# Altium schematic sheet CTR_Power_Supply.SchDoc: Power Supplies
size A4; DrawnBy: Andrei Divinagracia; Revision: 0A; SheetNumber: 4; SheetTotal: 10
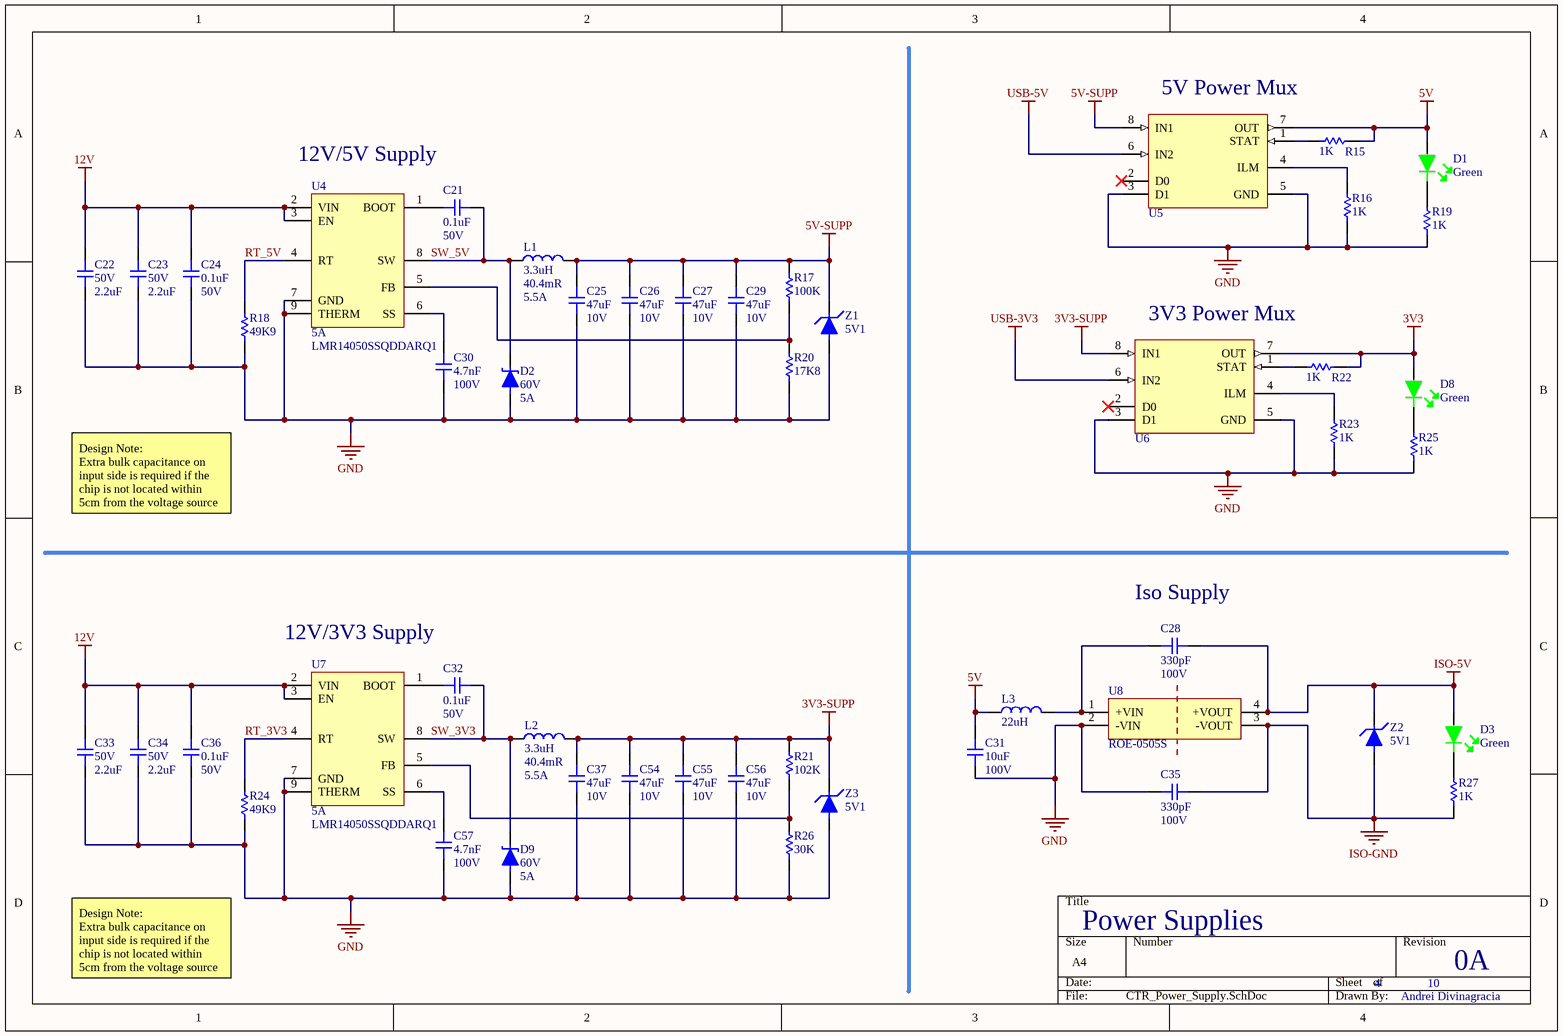
[diagram p0: CTR_Power_Supply.SchDoc]

## Parts
C21  0.1uF  Voltage Rating: 50V  [CAP-0603]
C22  Voltage Rating: 50V  Capacitance: 2.2uF  [CAP-0805]  (hidden comment: 0805-2.2uF-50V)
C23  Voltage Rating: 50V  Capacitance: 2.2uF  [CAP-0805]  (hidden comment: 0805-2.2uF-50V)
C24  0.1uF  Voltage Rating: 50V  [CAP-0603]
C25  47uF  Voltage Rating: 10V  [CAP-1206]
C26  47uF  Voltage Rating: 10V  [CAP-1206]
C27  47uF  Voltage Rating: 10V  [CAP-1206]
C28  330pF  Voltage Rating: 100V  [CAP-0805]
C29  47uF  Voltage Rating: 10V  [CAP-1206]
C30  4.7nF  Voltage Rating: 100V  [CAP-0603]
C31  10uF  Voltage Rating: 100V
C32  0.1uF  Voltage Rating: 50V  [CAP-0603]
C33  Voltage Rating: 50V  Capacitance: 2.2uF  [CAP-0805]  (hidden comment: 0805-2.2uF-50V)
C34  Voltage Rating: 50V  Capacitance: 2.2uF  [CAP-0805]  (hidden comment: 0805-2.2uF-50V)
C35  330pF  Voltage Rating: 100V  [CAP-0805]
C36  0.1uF  Voltage Rating: 50V  [CAP-0603]
C37  47uF  Voltage Rating: 10V  [CAP-1206]
C54  47uF  Voltage Rating: 10V  [CAP-1206]
C55  47uF  Voltage Rating: 10V  [CAP-1206]
C56  47uF  Voltage Rating: 10V  [CAP-1206]
C57  4.7nF  Voltage Rating: 100V  [CAP-0603]
D1  Green  [LED-0603]
D2  Voltage Rating (DC): 60V  Current Rating: 5A  [DO-214AB, SMC]  (hidden comment: B560C-13-F)
D3  Green  [LED-0603]
D8  Green  [LED-0603]
D9  Voltage Rating (DC): 60V  Current Rating: 5A  [DO-214AB, SMC]  (hidden comment: B560C-13-F)
L1  Inductance: 3.3uH  DC Resistance (DCR): 40.4mR  Current Rating: 5.5A  [INDM5252X30N]  (hidden comment: IND-3.3uH-5.5A)
L2  Inductance: 3.3uH  DC Resistance (DCR): 40.4mR  Current Rating: 5.5A  [INDM5252X30N]  (hidden comment: IND-3.3uH-5.5A)
L3  22uH  [IND-4532]
R15  1K  [RES-0603]
R16  1K  [RES-0603]
R17  100K
R18  49K9  [RES-0603]
R19  1K  [RES-0603]
R20  17K8  [RES-0603]
R21  102K  [RES-0603]
R22  1K  [RES-0603]
R23  1K  [RES-0603]
R24  49K9  [RES-0603]
R25  1K  [RES-0603]
R26  30K  [RES-0603]
R27  1K  [RES-0603]
U4  Output Current: 5A  [8-SOIC W THRM]  (hidden comment: LMR14050SSQDDARQ1)
U5  TPS2115APWR  [8-TSSOP-POW-SW]  (value not drawn)
U6  TPS2115APWR  [8-TSSOP-POW-SW]  (value not drawn)
U7  Output Current: 5A  [8-SOIC W THRM]  (hidden comment: LMR14050SSQDDARQ1)
U8  ROE-0505S  [ROE-0505S]
Z1  5V1  [SOD-123]
Z2  5V1  [SOD-123]
Z3  5V1  [SOD-123]

## Nets
3V3: D8.1 R22.2 U6.7(OUT)
3V3-SUPP: C37.2 C54.2 C55.2 C56.2 L2.2 R21.2 U6.8(IN1) Z3.1
5V: C31.2 D1.1 L3.1 R15.2 U5.7(OUT)
5V-SUPP: C25.2 C26.2 C27.2 C29.2 L1.2 R17.1 U5.8(IN1) Z1.1
12V: C22.1 C23.1 C24.2 C33.1 C34.1 C36.2 U4.2(VIN) U4.3(EN) U7.2(VIN) U7.3(EN)
GND: C22.2 C23.2 C24.1 C25.1 C26.1 C27.1 C29.1 C30.1 C31.1 C33.2 C34.2 C35.1 C36.1 C37.1 C54.1 C55.1 C56.1 C57.1 D2.2 D9.2 R16.1 R18.1 R19.1 R20.1 R23.1 R24.1 R25.1 R26.1 U4.7(GND) U4.9(THERM) U5.3(D1) U5.5(GND) U6.3(D1) U6.5(GND) U7.7(GND) U7.9(THERM) U8.2(-VIN) Z1.2 Z3.2
ISO-5V: C28.2 D3.1 U8.4(+VOUT) Z2.1
ISO-GND: C35.2 R27.1 U8.3(-VOUT) Z2.2
USB-3V3: U6.6(IN2)
USB-5V: U5.6(IN2)
RT_3V3: R24.2 U7.4(RT)
RT_5V: R18.2 U4.4(RT)
SW_3V3: C32.1 D9.1 L2.1 U7.8(SW)
SW_5V: C21.1 D2.1 L1.1 U4.8(SW)
NetC21_2: C21.2 U4.1(BOOT)
NetC28_1: C28.1 L3.2 U8.1(+VIN)
NetC30_2: C30.2 U4.6(SS)
NetC32_2: C32.2 U7.1(BOOT)
NetC57_2: C57.2 U7.6(SS)
NetD1_2: D1.2 R19.2
NetD3_2: D3.2 R27.2
NetD8_2: D8.2 R25.2
NetR15_1: R15.1 U5.1(STAT)
NetR16_2: R16.2 U5.4(ILM)
NetR17_2: R17.2 R20.2 U4.5(FB)
NetR21_1: R21.1 R26.2 U7.5(FB)
NetR22_1: R22.1 U6.1(STAT)
NetR23_2: R23.2 U6.4(ILM)

Not connected (* = marked no-connect by the designer): U5 2(D0)*; U6 2(D0)*

## Notes on the sheet
- (near U5) 5V Power Mux
- 12V/5V Supply
- 3V3 Power Mux
- Design Note:
  Extra bulk capacitance on input side is required if the chip is not located within 5cm from the voltage source
- 12V/3V3 Supply
- (near C28) Iso Supply

## Library data of the parts
C21 C24 C32 C36 = 0603-0.1uF-50V: CAP CER 0.1UF 50V X7R 0603; Manufacturer: Samsung; Manufacturer Part Number: CL10B104KB8NNNL; Capacitance: 100nF; Tolerance: 10%; Supplier 1: Digi-Key; Stock 1: 1355979; Pricing 1: 1=0.1, 10=0.03, 50=0.0164, 100=0.0134, 500=0.00958, 1000=0.00753, 2500=0.00684, 5000=0.0063 (USD); Mount: Surface Mount; Case/Package: 0603; Min Operating Temperature: -55°C; Max Operating Temperature: 125°C; Packaging: Tape and Reel; Package Quantity: 15000; Dielectric: X7R; Voltage Rating (DC): 50V; Series: CL; Construction: Flat; Length: 1.6mm; Width: 0.031inch; Height: 0.8mm; Thickness: 0.035inch; Depth: 0.8mm; Radiation Hardening: No; RoHS Compliant: Yes; ComponentLink1URL: https://www.verical.com/server-webapp/html/getDatasheet?partID=357523&src-supplier=Verical; ComponentLink1Description: https://www.verical.com/server-webapp/html/getDatasheet?partID=357523&src-supplier=Verical; ComponentLink2URL: https://media.digikey.com/pdf/Data%20Sheets/Samsung%20PDFs/CL_Series_MLCC_ds.pdf?src-supplier=Digi-Key; ComponentLink2Description: https://media.digikey.com/pdf/Data%20Sheets/Samsung%20PDFs/CL_Series_MLCC_ds.pdf?src-supplier=Digi-Key; Supplier Part Number 1: 1276-CL10B104KB8NNNLCT-ND
C22 C23 C33 C34 = 0805-2.2uF-50V: CAP CER 2.2UF 50V X5R 0805; Manufacturer: Samsung; Manufacturer Part Number: CL21A225KBFNNNE; Tolerance: 10%; Supplier 1: Digi-Key; Stock 1: 30848; Pricing 1: 1=0.25, 10=0.173, 50=0.1154, 100=0.0981, 500=0.06928, 1000=0.06062 (USD); Mount: Surface Mount; Case/Package: 0805; Case Code (Metric): 2012; Case Code (Imperial): 0805; Min Operating Temperature: -55°C; Max Operating Temperature: 85°C; Packaging: Tape and Reel; Dielectric: X5R; Voltage Rating (DC): 50V; Length: 0.079inch; Width: 0.049inch; Thickness: 0.053inch; ComponentLink1URL: http://www.samsungsem.com/kr/support/product-search/mlcc/CL21A225KBFNNNE.jsp?src-supplier=Digi-Key; ComponentLink1Description: http://www.samsungsem.com/kr/support/product-search/mlcc/CL21A225KBFNNNE.jsp?src-supplier=Digi-Key; Supplier Part Number 1: 1276-6702-1-ND
C25-C27 C29 C37 C54-C56 = 1206-47uF: CAP CER 47UF 10V X5R 1206; Manufacturer: Samsung; Manufacturer Part Number: CL31A476MPHNNNE; Material: Ceramic; Tolerance: 20%; Supplier 1: Digi-Key; Stock 1: 88504; Pricing 1: 1=0.5, 10=0.35, 50=0.2646, 100=0.2305, 500=0.1707, 1000=0.1451 (USD); Mount: Surface Mount; Case/Package: 1206; Case Code (Metric): 3216; Case Code (Imperial): 1206; Min Operating Temperature: -55°C; Max Operating Temperature: 85°C; Package Quantity: 1; Packaging: Tape and Reel; Capacitance: 47uF; Dielectric: X5R; Length: 3.2mm; Width: 0.063inch; Thickness: 0.071inch; Depth: 1.6mm; Radiation Hardening: No; RoHS Compliant: Yes; ComponentLink1URL: https://media.digikey.com/pdf/Data%20Sheets/Samsung%20PDFs/CL_Series_MLCC_ds.pdf?src-supplier=Digi-Key; ComponentLink1Description: https://media.digikey.com/pdf/Data%20Sheets/Samsung%20PDFs/CL_Series_MLCC_ds.pdf?src-supplier=Digi-Key; ComponentLink2URL: https://www.verical.com/server-webapp/html/getDatasheet?partID=467074&src-supplier=Verical; ComponentLink2Description: https://www.verical.com/server-webapp/html/getDatasheet?partID=467074&src-supplier=Verical; ComponentLink3URL: https://produktinfo.conrad.com/datenblaetter/450000-474999/452069-da-01-en-VS_KONDENSATOR_1206.pdf?src-supplier=Conrad; ComponentLink3Description: https://produktinfo.conrad.com/datenblaetter/450000-474999/452069-da-01-en-VS_KONDENSATOR_1206.pdf?src-supplier=Conrad; Supplier Part Number 1: 1276-3063-1-ND
C28 C35 = 0805-330pF-100V: CAP CER 330PF 100V X7R 0805; Manufacturer: Wurth Electronics; Manufacturer Part Number: 885012207113; Tolerance: 10%; Supplier 1: Digi-Key; Stock 1: 3105; Pricing 1: 1=0.1, 10=0.049, 100=0.0441, 500=0.03904 (USD); Mount: Surface Mount; Case/Package: 0805; Case Code (Imperial): 0805; Case Code (Metric): 2012; Min Operating Temperature: -55°C; Max Operating Temperature: 125°C; Packaging: Tape and Reel; Capacitance: 330pF; ComponentLink1URL: https://katalog.we-online.de/pbs/datasheet/885012207113.pdf?src-supplier=Digi-Key; ComponentLink1Description: https://katalog.we-online.de/pbs/datasheet/885012207113.pdf?src-supplier=Digi-Key; Supplier Part Number 1: 732-12232-6-ND
C30 C57 = 0603-4.7nF-100V: CAP CER 4700PF 100V X7R 0603; Manufacturer: TDK; Manufacturer Part Number: CGA3E2X7R2A472K080AA; Tolerance: 10%; Supplier 1: Digi-Key; Stock 1: 106501; Pricing 1: 1=0.1, 10=0.067, 50=0.0364, 100=0.0296, 500=0.02118, 1000=0.01664 (USD); Mount: Surface Mount; Case/Package: 0603; Case Code (Metric): 1608; Case Code (Imperial): 0603; Weight: 7.1E-05oz; Min Operating Temperature: -55°C; Max Operating Temperature: 125°C; Capacitance: 4.7nF; Packaging: Tape and Reel; Package Quantity: 1; Voltage Rating (DC): 100V; Dielectric: X7R; Termination: SMD/SMT; Resistor Type: Ceramic; Series: CGA; Length: 1.6mm; Width: 0.031inch; Height: 0.8mm; Thickness: 0.035inch; Depth: 0.8mm; Ratings: AEC-Q200; REACH SVHC: No SVHC; RoHS Compliant: Yes; ComponentLink1URL: http://www.farnell.com/datasheets/1807242.pdf?src-supplier=Element14; ComponentLink1Description: http://www.farnell.com/datasheets/1807242.pdf?src-supplier=Element14; ComponentLink2URL: http://www.mouser.com/ds/2/400/lcc_automotive_midvoltage_en-355485.pdf?src-supplier=Mouser; ComponentLink2Description: http://www.mouser.com/ds/2/400/lcc_automotive_midvoltage_en-355485.pdf?src-supplier=Mouser; Supplier Part Number 1: 445-5810-1-ND
C31 = 2220-10uF-100V: CAP CER 10UF 100V X7S 2220; Manufacturer: TDK; Manufacturer Part Number: C5750X7S2A106K230KB; Tolerance: 10%; Supplier 1: Digi-Key; Stock 1: 112223; Pricing 1: 1=2.24, 10=1.815, 50=1.584, 100=1.386 (USD); Mount: Surface Mount; Case/Package: 2220; Case Code (Metric): 5750; Case Code (Imperial): 2220; Weight: 0.016932oz; Min Operating Temperature: -55°C; Max Operating Temperature: 125°C; Package Quantity: 500; Packaging: Tape and Reel; Capacitance: 10uF; Dielectric: X7S; Termination: SMD/SMT; Voltage Rating (DC): 100V; Series: C; Length: 0.224inch; Width: 0.197inch; Height: 2.3mm; Thickness: 0.098inch; REACH SVHC: No SVHC; Lead Free: Lead Free; RoHS Compliant: Yes; ComponentLink1URL: https://4donline.ihs.com/images/VipMasterIC/IC/TDKC/TDKC-S-A0000596732/TDKC-S-A0000596732-1.pdf?hkey=52A5661711E402568146F3353EA87419&src-supplier=Farnell; ComponentLink1Description: https://4donline.ihs.com/images/VipMasterIC/IC/TDKC/TDKC-S-A0000596732/TDKC-S-A0000596732-1.pdf?hkey=52A5661711E402568146F3353EA87419&src-supplier=Farnell; ComponentLink2URL: http://www.farnell.com/datasheets/1913358.pdf?src-supplier=Element14; ComponentLink2Description: http://www.farnell.com/datasheets/1913358.pdf?src-supplier=Element14; ComponentLink3URL: https://product.tdk.com/info/en/documents/chara_sheet/C5750X7S2A106K230KB.pdf?src-supplier=Digi-Key; ComponentLink3Description: https://product.tdk.com/info/en/documents/chara_sheet/C5750X7S2A106K230KB.pdf?src-supplier=Digi-Key; ComponentLink4URL: http://www.mouser.com/ds/2/400/lcc_commercial_general_en-837201.pdf?src-supplier=Mouser; ComponentLink4Description: http://www.mouser.com/ds/2/400/lcc_commercial_general_en-837201.pdf?src-supplier=Mouser; ComponentLink5URL: https://4donline.ihs.com/images/VipMasterIC/IC/TDKC/TDKC-S-A0000596732/TDKC-S-A0000596732-1.pdf?hkey=52A5661711E402568146F3353EA87419&src-supplier=Newark; ComponentLink5Description: https://4donline.ihs.com/images/VipMasterIC/IC/TDKC/TDKC-S-A0000596732/TDKC-S-A0000596732-1.pdf?hkey=52A5661711E402568146F3353EA87419&src-supplier=Newark; ComponentLink6URL: http://product.tdk.com/en/catalog/datasheets/mlcc_commercial_midvoltage_en.pdf?src-supplier=Avnet; ComponentLink6Description: http://product.tdk.com/en/catalog/datasheets/mlcc_commercial_midvoltage_en.pdf?src-supplier=Avnet; Supplier Part Number 1: 445-13408-6-ND
D1 D3 D8 = LED-Green: LED GREEN CLEAR 0603 SMD; Manufacturer: Wurth Electronics; Manufacturer Part Number: 150060VS75000; Luminous Intensity: 40mcd; Viewing Angle: 140°; Forward Voltage: 2V; Wavelength: 570nm; Lens Style: Clear,Rectangular; Forward Current: 30mA; Test Current: 20mA; Supplier 1: Digi-Key; Stock 1: 118118; Pricing 1: 1=0.14, 50=0.133, 100=0.114, 500=0.099 (USD); Mount: Surface Mount; Case/Package: 0603; Number of Pins: 2; Color: Green; Case Code (Metric): 1608; Case Code (Imperial): 0603; Min Operating Temperature: -40°C; Max Operating Temperature: 85°C; Package Quantity: 1; Packaging: Tape and Reel; Dominant Wavelength: 570nm; Length: 1.6mm; Height: 0.7mm; Width: 0.8mm; REACH SVHC: Unknown; ComponentLink1URL: https://katalog.we-online.de/led/datasheet/150060VS75000.pdf?src-supplier=Digi-Key; ComponentLink1Description: https://katalog.we-online.de/led/datasheet/150060VS75000.pdf?src-supplier=Digi-Key; Supplier Part Number 1: 732-4980-1-ND
D2 D9 = B560C-13-F: DIODE SCHOTTKY 60V 5A SMC; Manufacturer: Diodes; Max Reverse Current: 500uA; Forward Voltage: 700mV; Max Forward Surge Current (Ifsm): 100A; Element Configuration: Single; Polarity: Standard; Capacitance: 300pF; Supplier 1: Digi-Key; Manufacturer Part Number: B560C-13-F; Stock 1: 50354; Pricing 1: 1=0.53, 10=0.454, 100=0.3388, 500=0.2662, 1000=0.2057 (USD); Mount: Surface Mount; Case/Package: SMC; Number of Pins: 2; Weight: 0.007408oz; Contact Plating: Tin,Matte; Min Operating Temperature: -55°C; Max Operating Temperature: 125°C; Package Quantity: 3000; Packaging: Tape and Reel; Forward Current: 5A; Max Repetitive Reverse Voltage (Vrrm): 60V; Average Rectified Current: 5A; Peak Non-Repetitive Surge Current: 100A; Termination: SMD/SMT; Output Current: 5A; Max Reverse Voltage (DC): 60V; Series: -; Length: 7.11mm; Width: 6.22mm; Height: 2.5mm; Radiation Hardening: No; REACH SVHC: No SVHC; Lead Free: Lead Free; RoHS Compliant: Yes; ComponentLink1URL: https://www.diodes.com/assets/Datasheets/ds13012.pdf?src-supplier=Digi-Key; ComponentLink1Description: https://www.diodes.com/assets/Datasheets/ds13012.pdf?src-supplier=Digi-Key; ComponentLink2URL: http://www.farnell.com/datasheets/2238476.pdf?src-supplier=Element14; ComponentLink2Description: http://www.farnell.com/datasheets/2238476.pdf?src-supplier=Element14; ComponentLink3URL: https://www.verical.com/server-webapp/html/getDatasheet?partID=89786&src-supplier=Verical; ComponentLink3Description: https://www.verical.com/server-webapp/html/getDatasheet?partID=89786&src-supplier=Verical; ComponentLink4URL: http://www.diodes.com/datasheets/ds13012.pdf?src-supplier=Future+Electronics; ComponentLink4Description: http://www.diodes.com/datasheets/ds13012.pdf?src-supplier=Future+Electronics; ComponentLink5URL: http://www.diodes.com//datasheets/ds13012.pdf?src-supplier=Avnet+Europe; ComponentLink5Description: http://www.diodes.com//datasheets/ds13012.pdf?src-supplier=Avnet+Europe; ComponentLink6URL: http://www.jameco.com/Jameco/Products/ProdDS/1538961.pdf?src-supplier=Jameco; ComponentLink6Description: http://www.jameco.com/Jameco/Products/ProdDS/1538961.pdf?src-supplier=Jameco; ComponentLink7URL: http://datasheet.iiic.cc/diodes/B560C-13-F.pdf?src-supplier=IIIC; ComponentLink7Description: http://datasheet.iiic.cc/diodes/B560C-13-F.pdf?src-supplier=IIIC; Supplier Part Number 1: B560C-FDICT-ND
L1 L2 = IND-3.3uH-5.5A: FIXED IND 3.3UH 5.5A 40.4MOHM SM; Manufacturer: Vishay Dale; Manufacturer Part Number: IHLP2020CZER3R3M11; Inductance Tolerance: 20%; Shielding: Shielded; Saturation Current: 7A; Self Resonant Frequency: 29MHz; Test Frequency: 100kHz; Supplier 1: Digi-Key; Stock 1: 17207; Pricing 1: 1=1.29, 10=1.194, 25=1.1024, 50=0.9188, 100=0.8636, 250=0.77176, 500=0.6615, 1000=0.588 (USD); Mount: Surface Mount; Case/Package: 2020; Contact Plating: Tin; Min Operating Temperature: -55°C; Max Operating Temperature: 125°C; Tolerance: 20%; Package Quantity: 2000; Packaging: Tape and Reel; Max DC Current: 7A; Termination: SMD/SMT; RMS Current (Irms): 5.5A; Series: IHLP-2020CZ-11; Rated Current-Max: 5.5A; Length: 5.74mm; Width: 0.204inch; Height: 3mm; Height - Seated (Max): 0.118inch; Depth: 5.43mm; Radiation Hardening: No; REACH SVHC: Unknown; Military Standard: Not; Lead Free: Lead Free; ComponentLink1URL: http://www.farnell.com/datasheets/480942.pdf?src-supplier=Element14; ComponentLink1Description: http://www.farnell.com/datasheets/480942.pdf?src-supplier=Element14; ComponentLink2URL: http://www.vishay.com/docs/34260/ihlp2020cz11.pdf?src-supplier=Digi-Key; ComponentLink2Description: http://www.vishay.com/docs/34260/ihlp2020cz11.pdf?src-supplier=Digi-Key; ComponentLink3URL: http://www.mouser.com/ds/2/427/ihlp2020cz11-270739.pdf?src-supplier=Mouser; ComponentLink3Description: http://www.mouser.com/ds/2/427/ihlp2020cz11-270739.pdf?src-supplier=Mouser; ComponentLink4URL: http://uk.rs-online.com/webdocs/102c/0900766b8102c930.pdf?src-supplier=RSComponents; ComponentLink4Description: http://uk.rs-online.com/webdocs/102c/0900766b8102c930.pdf?src-supplier=RSComponents; ComponentLink5URL: http://www.vishay.com/docs/34260/lp20cz11.pdf?src-supplier=Avnet; ComponentLink5Description: http://www.vishay.com/docs/34260/lp20cz11.pdf?src-supplier=Avnet; Supplier Part Number 1: 541-1237-1-ND
L3 = IND-22uH-630mA: FIXED IND 22UH 630MA 700MOHM SMD; Manufacturer: Recom; Manufacturer Part Number: RLS-226; Supplier 1: Digi-Key; Stock 1: 512; Pricing 1: 1=0.72, 5=0.714, 10=0.704, 25=0.6832, 50=0.6626, 250=0.62116, 500=0.57974 (USD); ComponentLink1URL: https://www.recom-power.com/pdf/Accessories/RLS-226.pdf?src-supplier=Digi-Key; ComponentLink1Description: https://www.recom-power.com/pdf/Accessories/RLS-226.pdf?src-supplier=Digi-Key; Supplier Part Number 1: 945-30004971-ND
R15 R16 R19 R22 R23 R25 R27 = 0603-1KR: RES SMD 1K OHM 1% 1/10W 0603; Manufacturer: Vishay Dale; Manufacturer Part Number: CRCW06031K00FKEA; Resistance: 1kR; Power Rating: 100mW; Voltage Rating: 75V; Temperature Coefficient: 100ppm/°C; Supplier 1: Digi-Key; Stock 1: 671453; Pricing 1: 1=0.1, 10=0.034, 100=0.0139, 1000=0.00623, 2500=0.0054 (USD); Mount: Surface Mount; Case/Package: 0603; Number of Pins: 2; Weight: 7.1E-05oz; Case Code (Metric): 1608; Case Code (Imperial): 0603; Contact Plating: Tin; Min Operating Temperature: -55°C; Max Operating Temperature: 155°C; Composition: Thick Film; Tolerance: 1%; Packaging: Tape and Reel; Package Quantity: 10; Number of Terminations: 2; Termination: SMD/SMT; Military Standard: Not; Max Power Dissipation: 100mW; Voltage Rating (DC): 75V; Features: Automotive AEC-Q200; Length: 1.55mm; Height: 0.45mm; Width: 0.033inch; Depth: 0.85mm; Radiation Hardening: No; REACH SVHC: Unknown; Lead Free: Lead Free; ComponentLink1URL: http://www.vishay.com/docs/20035/dcrcwe3.pdf?src-supplier=Digi-Key; ComponentLink1Description: http://www.vishay.com/docs/20035/dcrcwe3.pdf?src-supplier=Digi-Key; ComponentLink2URL: http://uk.rs-online.com/webdocs/0d98/0900766b80d98afc.pdf?src-supplier=RSComponents; ComponentLink2Description: http://uk.rs-online.com/webdocs/0d98/0900766b80d98afc.pdf?src-supplier=RSComponents; ComponentLink3URL: http://www.vishay.com/docs/20035/dcrcwe3.pdf?src-supplier=Avnet; ComponentLink3Description: http://www.vishay.com/docs/20035/dcrcwe3.pdf?src-supplier=Avnet; ComponentLink4URL: http://www.vishay.com/docs/20035/dcrcwe3.pdf?src-supplier=Avnet+Asia; ComponentLink4Description: http://www.vishay.com/docs/20035/dcrcwe3.pdf?src-supplier=Avnet+Asia; ComponentLink5URL: http://www.farnell.com/datasheets/2310790.pdf?src-supplier=Element14; ComponentLink5Description: http://www.farnell.com/datasheets/2310790.pdf?src-supplier=Element14; ComponentLink6URL: https://www.distrelec.biz/Web/Downloads/a_/en/flD-CRCW-e3_data_en.pdf?mime=application%2Fpdf&src-supplier=Distrelec; ComponentLink6Description: https://www.distrelec.biz/Web/Downloads/a_/en/flD-CRCW-e3_data_en.pdf?mime=application%2Fpdf&src-supplier=Distrelec; ComponentLink7URL: http://www.vishay.com/docs/20035/dcrcwe3.pdf?src-supplier=Future+Electronics; ComponentLink7Description: http://www.vishay.com/docs/20035/dcrcwe3.pdf?src-supplier=Future+Electronics; ComponentLink8URL: http://www.vishay.com/docs/20035/dcrcwe3.pdf?src-supplier=Avnet+Europe; ComponentLink8Description: http://www.vishay.com/docs/20035/dcrcwe3.pdf?src-supplier=Avnet+Europe; Supplier Part Number 1: 541-1.00KHCT-ND
R17 = 0603-100K: RES SMD 100K OHM 1% 1/10W 0603; Manufacturer: Yageo; Manufacturer Part Number: RC0603FR-07100KL; Resistance: 100kR; Power Rating: 100mW; Voltage Rating: 50V; Temperature Coefficient: 100ppm/°C; Working Voltage: 75V; Supplier 1: Digi-Key; Stock 1: 11174551; Pricing 1: 1=0.1, 10=0.024, 100=0.0097, 1000=0.00436, 2500=0.00378 (USD); Case/Package: 0603; Number of Pins: 2; Case Code (Imperial): 0603; Case Code (Metric): 1608; Min Operating Temperature: -55°C; Max Operating Temperature: 155°C; Tolerance: 1%; Packaging: Tape and Reel; Termination: SMD/SMT; Resistor Type: Thick Film; Number of Terminations: 2; Features: Moisture Resistant; Series: RC; Max Power Dissipation: 100mW; Resistance Tolerance: 1%; Construction: Rectangular; Voltage Rating (DC): 50V; Technology: THICK FILM; Length: 1.6mm; Width: 0.8mm; Height: 0.45mm; Depth: 0.8mm; REACH SVHC: No SVHC; Military Standard: Not; Lead Free: Lead Free; RoHS Compliant: Yes; ComponentLink1URL: http://www.farnell.com/datasheets/2167052.pdf?src-supplier=Element14; ComponentLink1Description: http://www.farnell.com/datasheets/2167052.pdf?src-supplier=Element14; ComponentLink2URL: http://www.farnell.com/datasheets/443971.pdf?src-supplier=Element14; ComponentLink2Description: http://www.farnell.com/datasheets/443971.pdf?src-supplier=Element14; ComponentLink3URL: http://documents.rs-components.com/techlib://itc_doclist_GB.htm?stockno=5048940&src-supplier=RSComponents; ComponentLink3Description: http://documents.rs-components.com/techlib://itc_doclist_GB.htm?stockno=5048940&src-supplier=RSComponents; ComponentLink4URL: http://www.farnell.com/datasheets/1868787.pdf?src-supplier=Element14; ComponentLink4Description: http://www.farnell.com/datasheets/1868787.pdf?src-supplier=Element14; Supplier Part Number 1: 311-100KHRCT-ND
R18 R24 = 0603-49K9: RES SMD 49.9KOHM 0.5% 1/10W 0603; Manufacturer: Vishay Dale; Manufacturer Part Number: CRCW060349K9DHEAP; Resistance: 49.9kR; Max Power Dissipation: 100mW; Temperature Coefficient: 50ppm/°C; Supplier 1: Digi-Key; Stock 1: 30757; Pricing 1: 1=0.3, 10=0.253, 100=0.0989, 1000=0.0414, 2500=0.03795 (USD); Case/Package: 0603; Case Code (Imperial): 0603; Case Code (Metric): 1608; Min Operating Temperature: -55°C; Max Operating Temperature: 155°C; Resistor Type: Thick Film; Features: Automotive AEC-Q200; Packaging: Tape and Reel; Tolerance: 0.5%; Number of Terminations: 2; Series: CRCW-P; RoHS Compliant: Yes; ComponentLink1URL: http://www.vishay.com/docs/20036/dcrcwpe3.pdf?src-supplier=Digi-Key; ComponentLink1Description: http://www.vishay.com/docs/20036/dcrcwpe3.pdf?src-supplier=Digi-Key; ComponentLink2URL: https://www.vishay.com/docs/20036/dcrcwpe3.pdf?src-supplier=Digi-Key; ComponentLink2Description: https://www.vishay.com/docs/20036/dcrcwpe3.pdf?src-supplier=Digi-Key; Supplier Part Number 1: 541-49.9KAYCT-ND
R20 = 0603-17K8: RES SMD 17.8K OHM 1% 1/10W 0603; Manufacturer: Yageo; Manufacturer Part Number: RC0603FR-0717K8L; Resistance: 17.8kR; Power Rating: 100mW; Voltage Rating: 75V; Temperature Coefficient: 100ppm/°C; Voltage Rating (DC): 50V; Supplier 1: Digi-Key; Stock 1: 302262; Pricing 1: 1=0.1, 10=0.024, 100=0.0097, 1000=0.00436, 2500=0.00378 (USD); Case/Package: 0603; Case Code (Metric): 1608; Case Code (Imperial): 0603; Size Code: 0603; Weight: 7.1E-05oz; Min Operating Temperature: -55°C; Max Operating Temperature: 155°C; Tolerance: 1%; Package Quantity: 1; Packaging: Tape and Reel; Resistor Type: Thick Film; Number of Terminations: 2; Termination: SMD/SMT; Max Power Dissipation: 100mW; Features: Moisture Resistant; Series: RC; Construction: Rectangular; Length: 1.6mm; Width: 0.031inch; Height: 0.022inch; Depth: 0.8mm; Military Standard: Not; Lead Free: Lead Free; RoHS Compliant: Yes; ComponentLink1URL: http://www.yageo.com/documents/recent/PYu-RC_Group_51_RoHS_L_10.pdf?src-supplier=Digi-Key; ComponentLink1Description: http://www.yageo.com/documents/recent/PYu-RC_Group_51_RoHS_L_10.pdf?src-supplier=Digi-Key; ComponentLink2URL: http://www.yageo.com/documents/recent/PYu-RC_Group_51_RoHS_L_9.pdf?src-supplier=Digi-Key; ComponentLink2Description: http://www.yageo.com/documents/recent/PYu-RC_Group_51_RoHS_L_9.pdf?src-supplier=Digi-Key; Supplier Part Number 1: 311-17.8KHRCT-ND
R21 = 0603-102K: RES SMD 102K OHM 1% 1/10W 0603; Manufacturer: Samsung; Manufacturer Part Number: RC1608F1023CS; Power Rating: 100mW; Resistance: 102kR; Temperature Coefficient: 100ppm/°C; Voltage Rating (DC): 50V; Supplier 1: Digi-Key; Stock 1: 4439; Pricing 1: 1=0.1, 10=0.074, 100=0.0285, 1000=0.01254, 2500=0.01083 (USD); Case/Package: 0603; Case Code (Metric): 1608; Case Code (Imperial): 0603; Contact Plating: Tin; Min Operating Temperature: -55°C; Max Operating Temperature: 155°C; Tolerance: 1%; Packaging: Tape and Reel; Resistor Type: Thick Film; Package Quantity: 1; Number of Terminations: 2; Max Power Dissipation: 100mW; Features: Moisture Resistant; Series: RC; Length: 0.063inch; Width: 0.031inch; Height: 0.022inch; Radiation Hardening: No; Lead Free: Lead Free; RoHS Compliant: Yes; ComponentLink1URL: https://produktinfo.conrad.com/datenblaetter/450000-474999/450136-da-01-en-WIDERSTAND_0603.pdf?src-supplier=Conrad; ComponentLink1Description: https://produktinfo.conrad.com/datenblaetter/450000-474999/450136-da-01-en-WIDERSTAND_0603.pdf?src-supplier=Conrad; Supplier Part Number 1: 1276-4839-1-ND
R26 = 0603-30KR: RES SMD 30K OHM 1% 1/10W 0603; Manufacturer: Yageo; Manufacturer Part Number: RC0603FR-0730KL; Resistance: 30kR; Power Rating: 100mW; Temperature Coefficient: 100ppm/°C; Voltage Rating (DC): 50V; Supplier 1: Digi-Key; Stock 1: 1047616; Pricing 1: 1=0.1, 10=0.023, 100=0.0094, 1000=0.00421, 2500=0.00366 (USD); Case/Package: 0603; Number of Pins: 2; Case Code (Imperial): 0603; Case Code (Metric): 1608; Min Operating Temperature: -55°C; Max Operating Temperature: 155°C; Tolerance: 1%; Packaging: Tape and Reel; Voltage Rating: 50V; Termination: SMD/SMT; Military Standard: Not; Composition: Thick Film; Package Quantity: 5000; Length: 1.6mm; Height: 0.45mm; Width: 0.8mm; Depth: 0.8mm; Lead Free: Lead Free; REACH SVHC: Unknown; ComponentLink1URL: http://www.mouser.com/catalog/specsheets/RC0603.pdf?src-supplier=Mouser; ComponentLink1Description: http://www.mouser.com/catalog/specsheets/RC0603.pdf?src-supplier=Mouser; ComponentLink2URL: http://www.farnell.com/datasheets/2167052.pdf?src-supplier=Element14; ComponentLink2Description: http://www.farnell.com/datasheets/2167052.pdf?src-supplier=Element14; Supplier Part Number 1: 311-30.0KHRDKR-ND
U4 U7 = LMR14050SSQDDARQ1: IC REG BUCK ADJUSTABLE 5A 8SOPWR; Manufacturer: Texas Instruments; Number of Outputs: 1; Min Input Voltage: 4V; Max Input Voltage: 40V; Min Output Voltage: 800mV; Max Output Voltage: 28V; Switching Frequency: 2.5MHz; Synchronous Rectifier: No; Quiescent Current: 40uA; Output Configuration: Positive; Supplier 1: Digi-Key; Stock 1: 3564; Pricing 1: 1=3.5, 10=3.143, 25=2.9716, 100=2.5755, 250=2.4434, 500=2.19246, 1000=2.08082 (USD); Mount: Surface Mount; Case/Package: SOIC; Min Operating Temperature: -40°C; Max Operating Temperature: 125°C; Packaging: Tape and Reel; Output Type: Adjustable; Lead Free: Lead Free; RoHS Compliant: Yes; ComponentLink1URL: http://www.ti.com/lit/ds/symlink/lmr14050-q1.pdf?src-supplier=Digi-Key; ComponentLink1Description: http://www.ti.com/lit/ds/symlink/lmr14050-q1.pdf?src-supplier=Digi-Key; ComponentLink2URL: http://www.ti.com/general/docs/suppproductinfo.tsp?distId=10&amp;gotoUrl=http%3A%2F%2Fwww.ti.com%2Flit%2Fgpn%2Flmr14050-q1&src-supplier=Digi-Key; ComponentLink2Description: http://www.ti.com/general/docs/suppproductinfo.tsp?distId=10&amp;gotoUrl=http%3A%2F%2Fwww.ti.com%2Flit%2Fgpn%2Flmr14050-q1&src-supplier=Digi-Key; ComponentLink3URL: http://www.ti.com/lit/gpn/lmr14050-q1?src-supplier=Mouser; ComponentLink3Description: http://www.ti.com/lit/gpn/lmr14050-q1?src-supplier=Mouser; Supplier Part Number 1: 296-43402-1-ND; Manufacturer Part Number: LMR14050SSQDDARQ1
U5 U6 = TPS2115APWR: IC OR CTRLR SRC SELECT 8TSSOP; Manufacturer: Texas Instruments; Number of Outputs: 1; Number of Inputs: 2; Output Current: 1.25A; Max Power Dissipation: 387mW; Max Input Voltage: 5.5V; Min Input Voltage: 2.8V; Turn-On Delay Time: 1ms; Turn-Off Delay Time: 5ms; Operating Supply Current: 55uA; On-State Resistance: 84mR; Output Voltage: 6V; Supplier 1: Digi-Key; Manufacturer Part Number: TPS2115APWR; Stock 1: 19599; Pricing 1: 1=2.48, 10=2.225, 25=2.0988, 100=1.7882, 250=1.67904, 500=1.46916, 1000=1.32264 (USD); Case/Package: TSSOP; Number of Pins: 8; Weight: 0.001376oz; Min Operating Temperature: -40°C; Max Operating Temperature: 85°C; Package Quantity: 2000; Packaging: Tape and Reel; Max Output Current: 1.25A; Current - Output 2: 1.25A; Operating Supply Voltage: 5.5V; Series: TPS2115A; Radiation Hardening: No; REACH SVHC: No SVHC; Lead Free: Lead Free; RoHS Compliant: Yes; ComponentLink1URL: http://www.ti.com/lit/ds/symlink/tps2115a.pdf?src-supplier=Newark; ComponentLink1Description: http://www.ti.com/lit/ds/symlink/tps2115a.pdf?src-supplier=Newark; ComponentLink2URL: http://www.ti.com/lit/ds/symlink/tps2114a.pdf?src-supplier=Digi-Key; ComponentLink2Description: http://www.ti.com/lit/ds/symlink/tps2114a.pdf?src-supplier=Digi-Key; ComponentLink3URL: http://www.ti.com/general/docs/lit/getliterature.tsp?genericPartNumber=TPS2115A&&fileType=pdf&src-supplier=Avnet; ComponentLink3Description: http://www.ti.com/general/docs/lit/getliterature.tsp?genericPartNumber=TPS2115A&&fileType=pdf&src-supplier=Avnet; ComponentLink4URL: https://www.verical.com/server-webapp/html/getDatasheet?partID=237877&src-supplier=Verical; ComponentLink4Description: https://www.verical.com/server-webapp/html/getDatasheet?partID=237877&src-supplier=Verical; Supplier Part Number 1: 296-16940-1-ND
U8 = ROE-0505S: Module DC-DC 5VIN 1-OUT 5V 0.2A 1W 4-Pin SIP Tube; Manufacturer: Recom; Min Input Voltage: 4.5V; Max Input Voltage: 5.5V; Number of Outputs: 1; Max Output Current: 200mA; Efficiency: 75%; Isolation Voltage: 1kV; Isolation: Isolated; Supplier 1: Digi-Key; Stock 1: 9959; Pricing 1: 1=2.86, 5=2.822, 10=2.782, 25=2.6996, 50=2.618, 100=2.5361, 250=2.45432, 500=2.29068 (USD); Mount: Through Hole; Case/Package: SIP; Number of Pins: 4; Weight: 1.4g; Min Operating Temperature: -40°C; Max Operating Temperature: 85°C; Nominal Output Voltage: 5V; Output Current: 200mA; Output Voltage: 5V; Power Rating: 1W; Nominal Input Voltage: 5V; Output Power: 1W; Package Quantity: 42; Packaging: Rail/Tube; Min Input Voltage (DC): 4.5V; Voltage - Output 1: 5V; Current - Output 1: 200mA; Max Input Voltage (DC): 5.5V; Max Output Power: 1W; Max Power Dissipation: 1W; Max Output Voltage: 5V; Series: ROE; Length: 11.5mm; Width: 6mm; Height: 10mm; Depth: 6mm; REACH SVHC: No SVHC; Lead Free: Lead Free; RoHS Compliant: Yes; ComponentLink1URL: http://www.farnell.com/datasheets/2787770.pdf?src-supplier=Element14; ComponentLink1Description: http://www.farnell.com/datasheets/2787770.pdf?src-supplier=Element14; ComponentLink2URL: http://uk.rs-online.com/webdocs/1373/0900766b81373201.pdf?src-supplier=RSComponents; ComponentLink2Description: http://uk.rs-online.com/webdocs/1373/0900766b81373201.pdf?src-supplier=RSComponents; ComponentLink3URL: http://www.mouser.com/ds/2/468/ROE-766139.pdf?src-supplier=Mouser; ComponentLink3Description: http://www.mouser.com/ds/2/468/ROE-766139.pdf?src-supplier=Mouser; ComponentLink4URL: https://www.recom-power.com/pdf/Econoline/ROE.pdf?src-supplier=Digi-Key; ComponentLink4Description: https://www.recom-power.com/pdf/Econoline/ROE.pdf?src-supplier=Digi-Key; ComponentLink5URL: http://www.recom-international.com/pdf/Econoline/ROE.pdf?src-supplier=Future+Electronics; ComponentLink5Description: http://www.recom-international.com/pdf/Econoline/ROE.pdf?src-supplier=Future+Electronics; ComponentLink6URL: http://www.produktinfo.conrad.com/datenblaetter/675000-699999/676228-da-01-en-DC_DC_WANDLER_ROE_0505S.pdf?src-supplier=Conrad; ComponentLink6Description: http://www.produktinfo.conrad.com/datenblaetter/675000-699999/676228-da-01-en-DC_DC_WANDLER_ROE_0505S.pdf?src-supplier=Conrad; Supplier Part Number 1: 945-1655-5-ND; Manufacturer Part Number: ROE-0505S
Z1-Z3 = SZMMSZ4689T1G: DIODE ZENER 5.1V 500MW SOD123; Manufacturer: ON Semiconductor; Tolerance: 5%; Max Reverse Leakage Current: 10uA; Test Current: 50uA; Element Configuration: Single; ESD Protection: Yes; Supplier 1: Digi-Key; Manufacturer Part Number: SZMMSZ4689T1G; Stock 1: 59493; Pricing 1: 1=0.37, 10=0.274, 100=0.1551, 500=0.10272, 1000=0.07875 (USD); Case/Package: SOD-123-2; Number of Pins: 2; Contact Plating: Tin,Matte; Min Operating Temperature: -55°C; Max Operating Temperature: 150°C; Package Quantity: 3000; Max Power Dissipation: 500mW; Packaging: Tape and Reel; Zener Voltage: 5.1V; Voltage Tolerance: 5%; Power Dissipation: 500mW; Series: -; Length: 2.84mm; Width: 1.8mm; Height: 1.25mm; Radiation Hardening: No; REACH SVHC: No SVHC; Lead Free: Lead Free; RoHS Compliant: Yes; ComponentLink1URL: http://www.onsemi.com/pub/Collateral/MMSZ4678T1-D.PDF?src-supplier=Avnet; ComponentLink1Description: http://www.onsemi.com/pub/Collateral/MMSZ4678T1-D.PDF?src-supplier=Avnet; ComponentLink2URL: http://www.onsemi.com/pub/Collateral/MMSZ4678T1-D.PDF?src-supplier=Digi-Key; ComponentLink2Description: http://www.onsemi.com/pub/Collateral/MMSZ4678T1-D.PDF?src-supplier=Digi-Key; Supplier Part Number 1: SZMMSZ4689T1GOSCT-ND